# EAGLE design Ring_Switch_PCB_FFC (EAGLE 9.6.2)
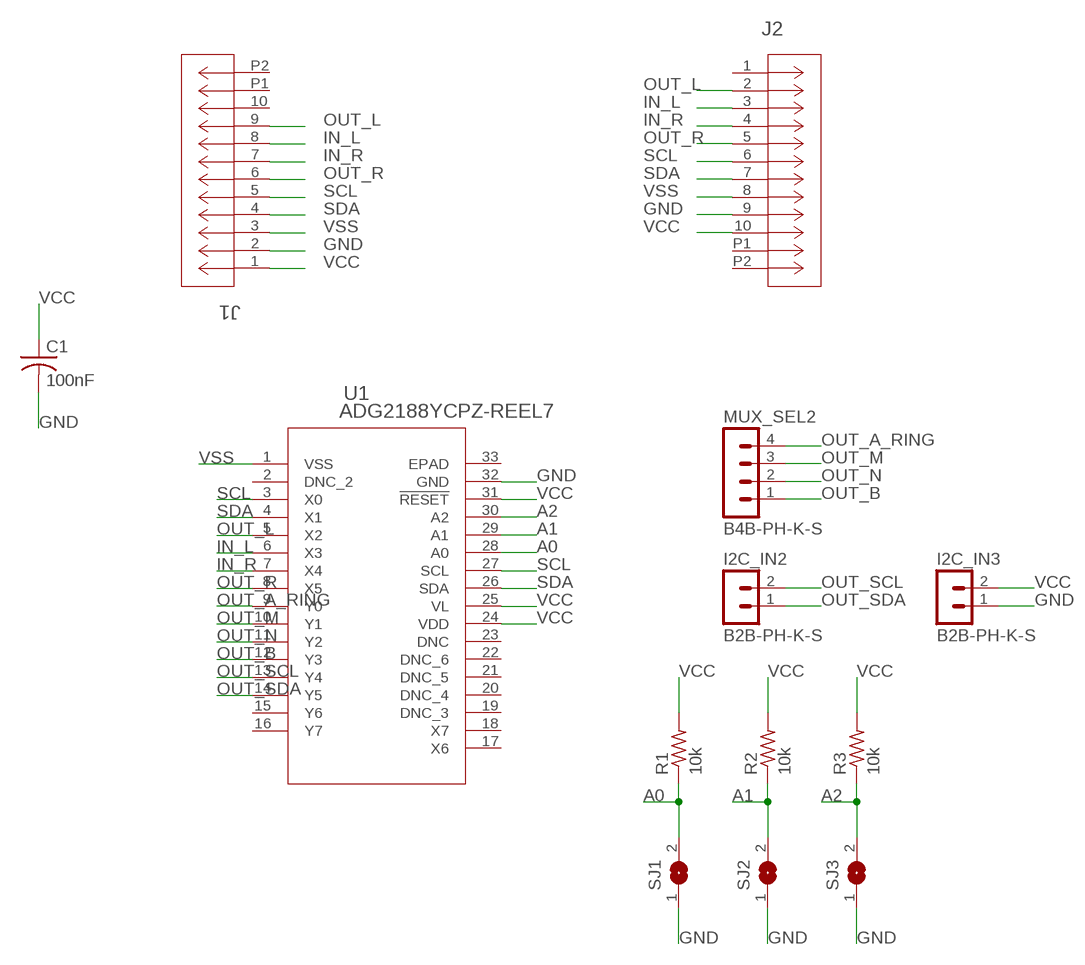
[diagram p0: schematic, sheet 1]

## Parts
C1  100nF  C-USC0603  [C0603]
I2C_IN2  B2B-PH-K-S  [B2B-PH-K-S]
I2C_IN3  B2B-PH-K-S  [B2B-PH-K-S]
J1  522711079  [CON_522711079_MOL]
J2  522711079  [CON_522711079_MOL]
MUX_SEL2  B4B-PH-K-S  [B4B-PH-K-S]
R1  10k  R-US_R0603  [R0603]
R2  10k  R-US_R0603  [R0603]
R3  10k  R-US_R0603  [R0603]
SJ1  SJ  [SJ]
SJ2  SJ  [SJ]
SJ3  SJ  [SJ]
U1  ADG2188YCPZ-REEL7  [CP_32_7_ADI]

## Nets
A0: R1.1 SJ1.2 U1.28(A0)
A1: R2.1 SJ2.2 U1.29(A1)
A2: R3.1 SJ3.2 U1.30(A2)
GND: C1.2 I2C_IN3.1 J1.2 J2.9 SJ1.1 SJ2.1 SJ3.1 U1.32(GND)
IN_L: J1.8 J2.3 U1.6(X3)
IN_R: J1.7 J2.4 U1.7(X4)
OUT_A_RING: MUX_SEL2.4 U1.9(Y0)
OUT_B: MUX_SEL2.1 U1.12(Y3)
OUT_L: J1.9 J2.2 U1.5(X2)
OUT_M: MUX_SEL2.3 U1.10(Y1)
OUT_N: MUX_SEL2.2 U1.11(Y2)
OUT_R: J1.6 J2.5 U1.8(X5)
OUT_SCL: I2C_IN2.2 U1.13(Y4)
OUT_SDA: I2C_IN2.1 U1.14(Y5)
SCL: J1.5 J2.6 U1.3(X0) U1.27(SCL)
SDA: J1.4 J2.7 U1.4(X1) U1.26(SDA)
VCC: C1.1 I2C_IN3.2 J1.1 J2.10 R1.2 R2.2 R3.2 U1.24(VDD) U1.25(VL) U1.31(!RESET)
VSS: J1.3 J2.8 U1.1(VSS)
Unconnected: J1.10 J1.P1 J1.P2 J2.1 J2.P1 J2.P2 U1.2(DNC_2) U1.15(Y6) U1.16(Y7) U1.17(X6) U1.18(X7) U1.19(DNC_3) U1.20(DNC_4) U1.21(DNC_5) U1.22(DNC_6) U1.23(DNC) U1.33(EPAD)

## Library data of the parts
C1 = adafruit:C-US: CAPACITOR, American symbol
I2C_IN2 I2C_IN3 = 2_pin_JST:B2B-PH: JST PH series header 2.00mm pitch disconnectable crimp style connectors, vertical (side entry type), 2 pins
J1 J2 = 0522711079:522711079; COPYRIGHT: Copyright (C) 2023 Ultra Librarian. All rights reserved.; MANUFACTURER_PART_NUMBER: 522711079; MFR_NAME: Molex Connector Corporation
MUX_SEL2 = 2_pin_JST:B4B-PH: JST PH series header 2.00mm pitch disconnectable crimp style connectors, vertical (side entry type), 4 pins
R1-R3 = adafruit:R-US_: RESISTOR, American symbol
SJ1-SJ3 = jumper:SJ: SMD solder JUMPER
U1 = ADG2188:ADG2188YCPZ-REEL7; BUILT_BY: EMA_Christopher; COPYRIGHT: Copyright (C) 2016 Accelerated Designs. All rights reserved; MANUFACTURER_PART_NUMBER: ADG2188YCPZ-REEL7; SOURCELIBRARY: Analog_Devices_2018-07-13; VENDOR: Analog Devices Inc

## Board
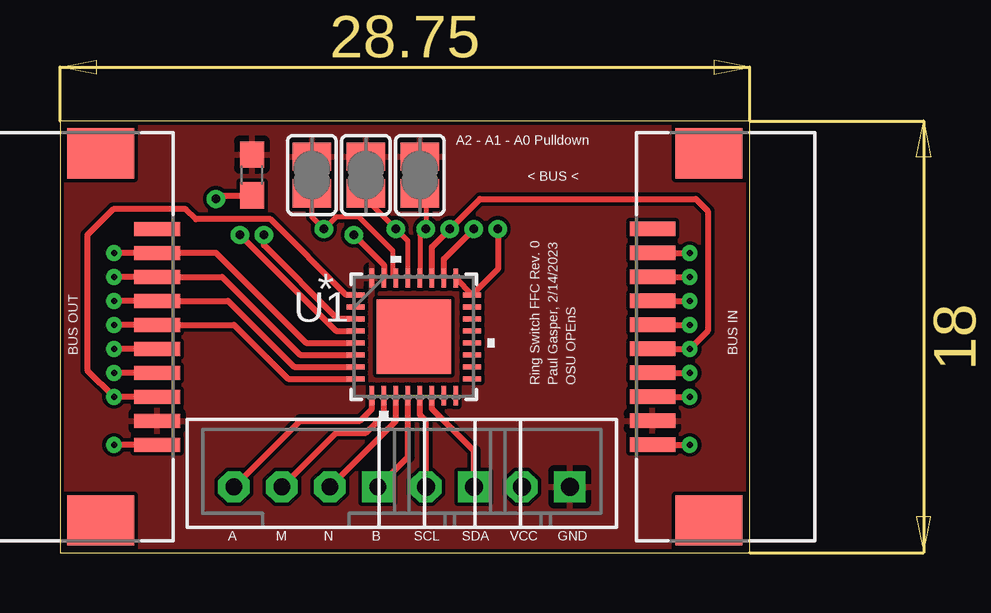
[diagram p1: board, top side]
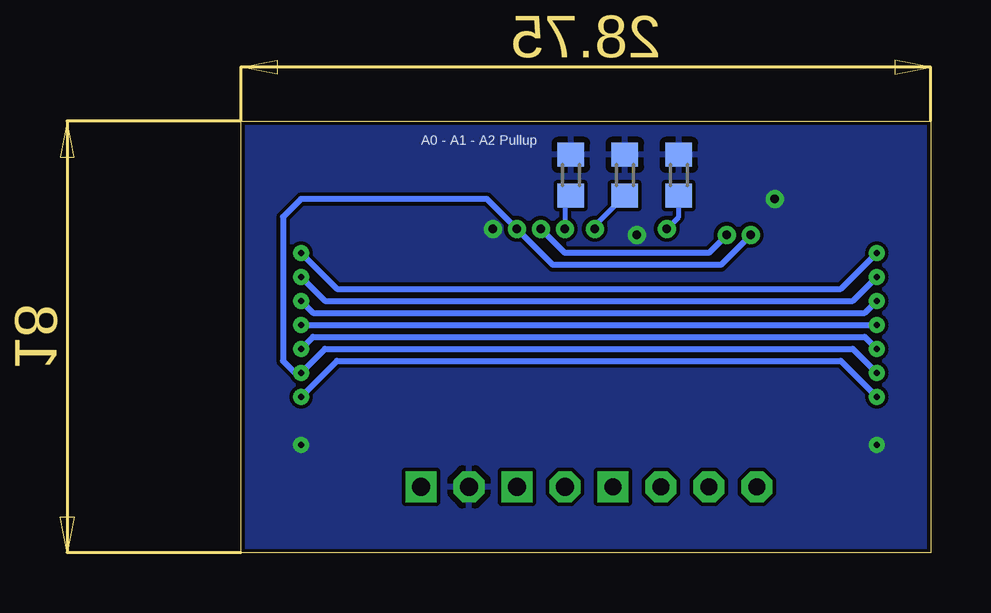
[diagram p2: board, bottom side, seen from below]

Size 28.75 x 18 mm. Coordinates in mm from the lower left corner, seen from the top.
Outline: 0,0 28.75,0 28.75,18 0,18 0,0
Copper layers (1*16): Top 0.035mm / dielectric 1.5mm / Bottom 0.035mm
Design rules "default *": minimum track width 6mil, minimum drill 0.35mm, track to track 6mil, track to pad 6mil, pad to pad 6mil, via to via 6mil, smd to smd 6mil, copper to edge 6mil, drill to drill 6mil, minimum pad ring 10mil, minimum via ring 8mil, stop-mask expansion 4mil, vias tented up to drill 0mil, thermal gap 10mil

### Footprints (pad centres in the part's own frame; a part is rotated, then mirrored left to right if it is on the bottom)
C0603 = smd 1.1 x 1: 1 -0.85,0; 2 0.85,0
B2B-PH-K-S = drill 0.75 pad 1.3 square: 1 1,0 | drill 0.75 pad 1.3 octagon: 2 -1,0
CON_522711079_MOL = smd 0.6 x 1.9: 1 -4.5,3.05; 2 -3.5,3.05; 3 -2.5,3.05; 4 -1.5,3.05; 5 -0.5,3.05; 6 0.5,3.05; 7 1.5,3.05; 8 2.5,3.05; 9 3.5,3.05; 10 4.5,3.05 | smd 2.1 x 2.8: P1 -7.65,0.7; P2 7.65,0.7
B4B-PH-K-S = drill 0.7 pad 1.3 square: 1 3,0 | drill 0.7 pad 1.3 octagon: 2 1,0; 3 -1,0; 4 -3,0
R0603 = smd 1 x 1.1: 1 -0.85,0; 2 0.85,0
SJ = smd 1.168 x 1.6: 1 -0.762,0; 2 0.762,0
CP_32_7_ADI = smd 0.755 x 0.199: 1 -2.427,1.75; 2 -2.427,1.25; 3 -2.427,0.75; 4 -2.427,0.25; 5 -2.427,-0.25; 6 -2.427,-0.75; 7 -2.427,-1.25; 8 -2.427,-1.75; 17 2.427,-1.75; 18 2.427,-1.25; 19 2.427,-0.75; 20 2.427,-0.25; 21 2.427,0.25; 22 2.427,0.75; 23 2.427,1.25; 24 2.427,1.75 | smd 0.199 x 0.805: 9 -1.75,-2.452; 10 -1.25,-2.452; 11 -0.75,-2.452; 12 -0.25,-2.452; 13 0.25,-2.452; 14 0.75,-2.452; 15 1.25,-2.452; 16 1.75,-2.452; 25 1.75,2.452; 26 1.25,2.452; 27 0.75,2.452; 28 0.25,2.452; 29 -0.25,2.452; 30 -0.75,2.452; 31 -1.25,2.452; 32 -1.75,2.452 | smd 3.1 x 3.1: 33 0,0

### Placement (x,y rotation side)
C1  8,15.75 90 top
I2C_IN2  16.25,2.75 0 top
I2C_IN3  20.25,2.75 0 top
J1  27.75,9 90 top
J2  1,9 270 top
MUX_SEL2  10.25,2.75 0 top
R1  15,15.75 90 bottom
R2  12.75,15.75 90 bottom
R3  10.5,15.75 90 bottom
SJ1  15,15.75 270 top
SJ2  12.75,15.75 270 top
SJ3  10.5,15.75 270 top
U1  14.75,9 0 top

### Tracks (layer width: path | path; a pad name or v marks a point on that pad's centre or on a via)
A0  (via drill 0.35)
  Top 0.2: U1.28 15,13.25 v15.25,13.5 15.25,14.74
  Top 0.254: SJ1.2 15.25,14.74
  Bottom 0.2: 15.25,14.65 v15.25,13.5
  Bottom 0.254: R1.1 15.25,14.65
A1  (via drill 0.35)
  Top 0.2: SJ2.2 12.75,14.75 v14,13.5 14.5,13 U1.29
  Bottom 0.2: v14,13.5 14,13.65 R2.1
A2  (via drill 0.35)
  Top 0.2: U1.30 13.88,11.57 13.88,12.58 12.46,14 11.5,14 v11,13.5 10.5,14 SJ3.2
  Bottom 0.2: v11,13.5 10.5,14 R3.1
GND
  Top 0.254: C1.2 8,16.75
  pour Top: 0,0 0,18 28.75,18 28.75,0
IN_L  (via drill 0.25)
  Top 0.254: U1.6 10,8.25 6.75,11.5 J2.3 v2.25,11.5 | v2.25,11.5 | J1.8 v26.25,11.5 | v26.25,11.5
  Bottom 0.254: v2.25,11.5 3.25,10.5 25.25,10.5 v26.25,11.5
IN_R  (via drill 0.25)
  Top 0.254: U1.7 9.75,7.75 7,10.5 J2.4 v2.25,10.5 | v2.25,10.5 | J1.7 v26.25,10.5 | v26.25,10.5
  Bottom 0.254: v26.25,10.5 25.75,10 2.75,10 v2.25,10.5
OUT_A_RING
  Top 0.254: MUX_SEL2.4 10,5.5 12.5,5.5 13,6 U1.9
OUT_B
  Top 0.254: MUX_SEL2.1 14.5,4 U1.12
OUT_L  (via drill 0.25)
  Top 0.254: U1.5 10.25,8.75 6.5,12.5 J2.2 v2.25,12.5 | v2.25,12.5 | J1.9 v26.25,12.5 | v26.25,12.5
  Bottom 0.254: v26.25,12.5 24.75,11 3.75,11 v2.25,12.5
OUT_M
  Top 0.254: MUX_SEL2.3 11.5,5 12.75,5 13.5,5.75 U1.10
OUT_N
  Top 0.254: MUX_SEL2.2 14,5.5 U1.11
OUT_R  (via drill 0.25)
  Top 0.254: U1.8 9.5,7.25 7.25,9.5 J2.5 v2.25,9.5 | v2.25,9.5 | J1.6 v26.25,9.5 | v26.25,9.5
  Bottom 0.254: v26.25,9.5 v2.25,9.5
OUT_SCL
  Top 0.254: I2C_IN2.2 15.25,5.5 15,5.75 U1.13
OUT_SDA
  Top 0.254: I2C_IN2.1 17.25,4.25 15.5,6 U1.14
SCL  (via drill 0.25, 0.35)
  Top 0.254: J2.6 v2.25,8.5 | v2.25,8.5 | J1.5 v26.25,8.5 | v26.25,8.5 | U1.3 11.57,9.75 8.5,12.82 v8.5,13.25 | U1.27 15.5,12.75 v16.25,13.5 17.5,14.75 26.5,14.75 27,14.25 27,9.25 v26.25,8.5
  Bottom 0.254: v2.25,8.5 2.75,9 25.75,9 v26.25,8.5 | v8.5,13.25 9.25,12.5 15.25,12.5 v16.25,13.5
SDA  (via drill 0.25, 0.35)
  Top 0.254: J2.7 v2.25,7.5 | v2.25,7.5 | J1.4 v26.25,7.5 | v26.25,7.5 | v7.5,13.25 11.5,9.25 U1.4 | U1.26 16,12.25 v17.25,13.5
  Bottom 0.254: v2.25,7.5 3.25,8.5 25.25,8.5 v26.25,7.5 26.5,7.5 27,8 27,14 26.25,14.75 18.5,14.75 v17.25,13.5 15.75,12 8.75,12 v7.5,13.25
VCC  (via drill 0.25, 0.35)
  Top 0.2: 17.18,10.77 U1.24
  Top 0.254: U1.25 17.18,10.77 | 8,14.5 C1.1 6.65,14.9 v6.5,14.75 | U1.24 18.25,11.82 v18.25,13.5 | J2.10 v2.25,4.5 | v2.25,4.5 | J1.1 v26.25,4.5 | v26.25,4.5 | v12.25,13.25 13.5,12 U1.31
  pour Bottom: 0,18 28.75,18 28.75,0 0,0
VSS  (via drill 0.25)
  Top 0.254: J2.8 v2.25,6.5 | v2.25,6.5 | J1.3 v26.25,6.5 | v26.25,6.5 | 12.25,10.75 U1.1 11.93,10.75 8.77,13.91 5.67,13.91 5.25,14.33 2.22,14.33 1.14,13.25 1.14,7.61 v2.25,6.5
  Bottom 0.254: v26.25,6.5 24.75,8 3.75,8 v2.25,6.5

### Text on the board
tNames: A2 - A1 - A0 Pulldown | < BUS < | BUS OUT | BUS IN | Ring Switch FFC Rev. 0 | Paul Gasper, 2/14/2023 | OSU OPEnS | A | M | N | B | SCL | SDA | VCC | GND
bNames: A0 - A1 - A2 Pullup